# EAGLE schematic Schematic (EAGLE 9.6.2)
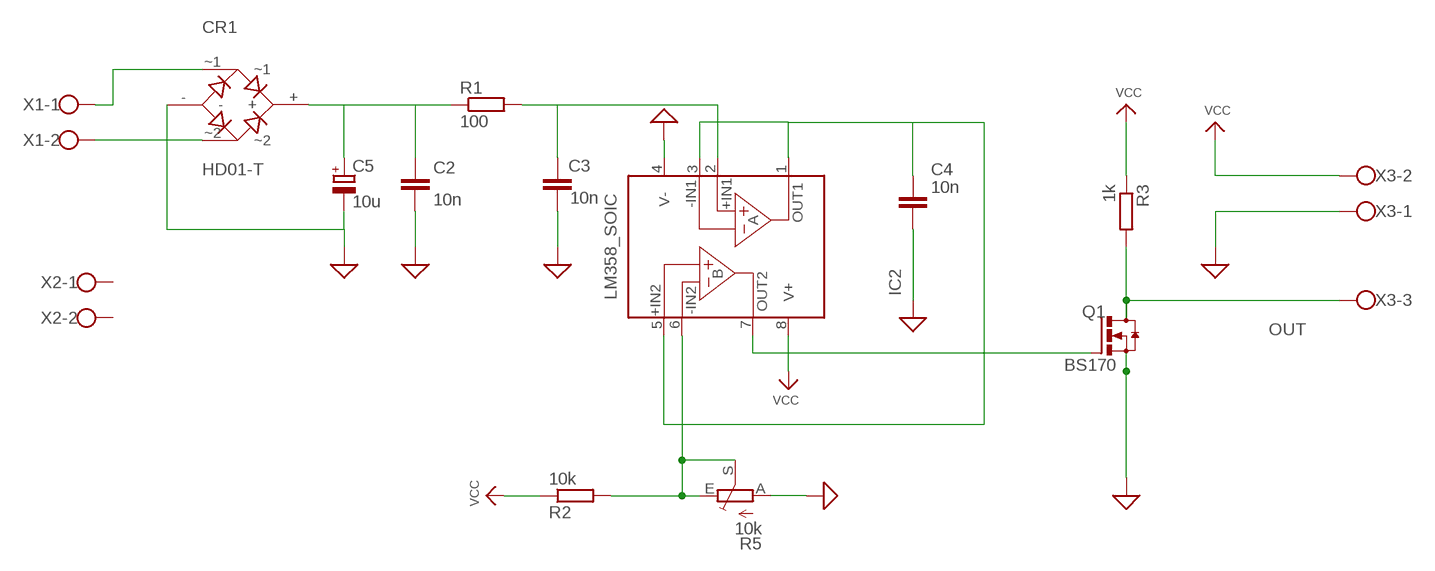
[diagram p0: schematic, sheet 1]

## Parts
C2  10n  C_CHIP-0603(1608-METRIC)  [CAPC1608X85]
C3  10n  C_CHIP-0603(1608-METRIC)  [CAPC1608X85]
C4  10n  C_CHIP-0603(1608-METRIC)  [CAPC1608X85]
C5  10u  CPOL-EU140CLH-1010  [140CLH-1010]
CR1  HD01-T  [HD01-T]
IC2  LM358_SOIC  [SOIC127P600X175-8N]
Q1  BS170  [TO92-3]
R1  100  R-EU_R0603  [R0603]
R2  10k  R-EU_R0603  [R0603]
R3  1k  R-EU_R0603  [R0603]
R5  10k  TRIM_EU-B90P  [SP19L]
X1  W237-102  [W237-102]
X2  W237-102  [W237-102]
X3  W237-103  [W237-103]

## Nets
GND: C2.2 C3.2 C4.2 C5.- CR1.- IC2.4(V-) Q1.3(S) R5.A X3.1 ; supply symbol labelled SUP
N$1: C2.1 C5.+ CR1.+ R1.1
N$2: C3.1 IC2.2(-IN1) R1.2
N$3: IC2.6(-IN2) R2.2 R5.E R5.S
N$4: C4.1 IC2.1(OUT1) IC2.3(+IN1) IC2.5(+IN2)
N$5: CR1.~1 X1.1
N$6: IC2.7(OUT2) Q1.2(G)
N$10: CR1.~2 X1.2
OUT: Q1.1(D) R3.2 X3.3
VCC: IC2.8(V+) R2.1 R3.1 X3.2
Unconnected: X2.1 X2.2

## Library data of the parts
C2-C4 = Capacitor:C: Capacitor - Generic; CATEGORY: Capacitor
C5 = rcl:CPOL-EU: POLARIZED CAPACITOR, European symbol; SPICEPREFIX: C
CR1 = Bridge Rectifiers:HD01-T: BRIDGE RECT 1P 100V 800MA 4-DIP Manufacturer's datasheet <https://www.diodes.com/assets/Datasheets/products_inactive_data/ds17003.pdf>; CREATED_BY: PCBLayout.com; DIGIKEY_PN: HD01DITR-ND; MANUFACTURER: Diodes Incorporated; MPN: HD01-T; PACKAGE: 4-MiniDIP
IC2 = IC_Linear:LM358: Dual Operational Amplifier Reference Datasheet <https://www.ti.com/lit/ds/symlink/lm158-n.pdf>; CATEGORY: Amplifier; DESCRIPTION: Dual Operational Amplifier; MANUFACTURER: Generic; MPN: Generic; SERIES: LM358; SUB-CATEGORY: OpAmp; TYPE: Dual
Q1 = Transistor:BS170: MOSFET N-CH 60V 300MA TO92-3 Manufacturer's datasheet <https://rocelec.widen.net/view/pdf/fonxoqycul/FAIRS29185-1.pdf?t.download=true&u=5oefqw>; CREATED_BY: PCBLayout.com; DIGIKEY_PART_NUMBER: 2156-BS170-ND; MANUFACTURER: Fairchild Semiconductor; MPN: BS170; PACKAGE: TO92-3
R1-R3 = rcl:R-EU_: RESISTOR, European symbol; SPICEPREFIX: R
R5 = pot:TRIM_EU-: POTENTIOMETER
X1 X2 = con-wago-500:W237-102: WAGO SCREW CLAMP; MPN: 237-102; OC_FARNELL: unknown; OC_NEWARK: 70K9898
X3 = con-wago-500:W237-103: WAGO SCREW CLAMP; MPN: 237-103; OC_FARNELL: unknown; OC_NEWARK: 18M7116